# EAGLE design buffer-teensy (EAGLE 7.6.0)
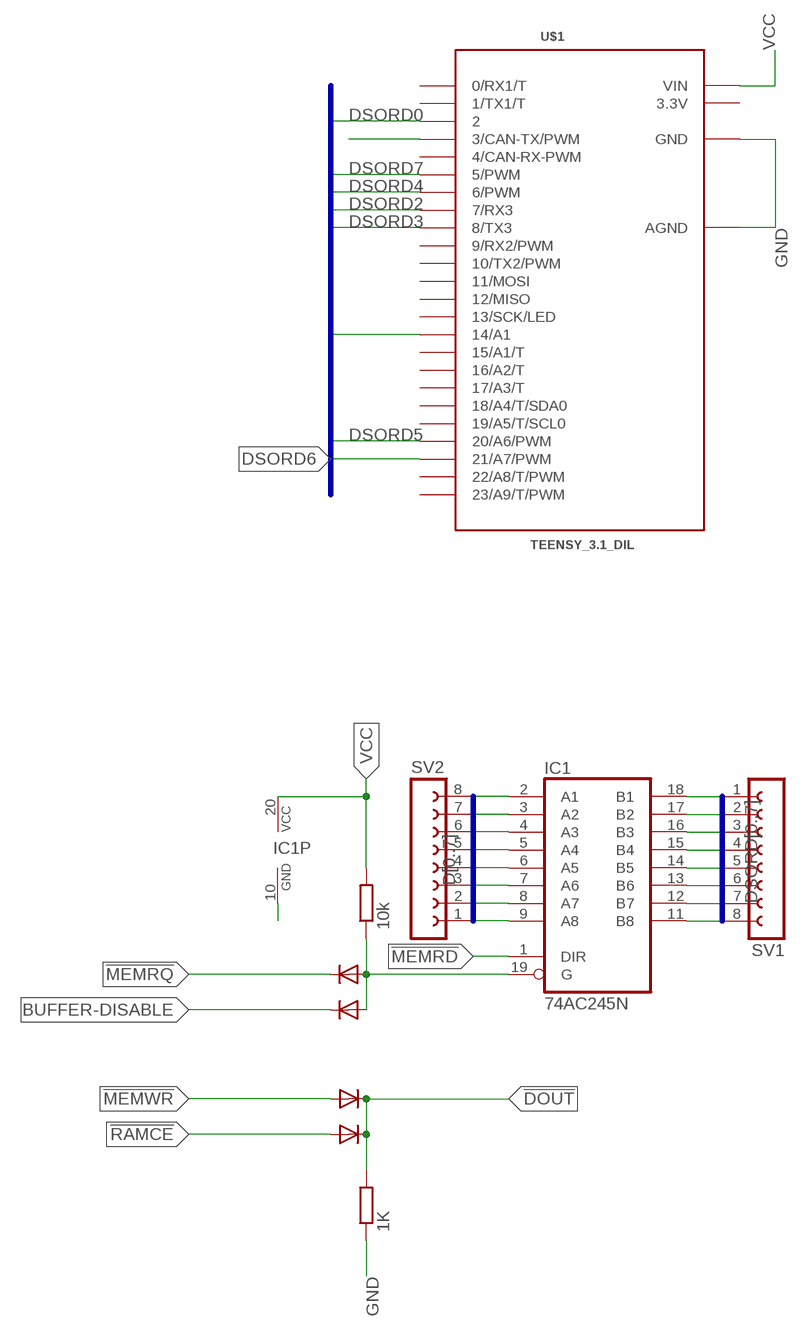
[diagram p0: schematic, sheet 1]

## Parts
D1  1N4148DO35-7  [DO35-7]
D2  1N4148DO35-7  [DO35-7]
D3  1N4148DO35-7  [DO35-7]
D4  1N4148DO35-7  [DO35-7]
IC1  74AC245N  [DIL20]
R1  10k  R-EU_0204/7  [0204/7]
R2  1K  R-EU_0204/7  [0204/7]
SV1  FE08-1  [FE08]
SV2  FE08-1  [FE08]
U$1  TEENSY_3.1_DIL  [TEENSY3-DIL]

## Nets
!DOUT: D3.C D4.C R2.2 U$1.3(3/CAN-TX/PWM)
!MEMRD: IC1.1(DIR)
!MEMRQ: D1.C
!MEMWR: D3.A
!RAMCE: D4.A
BUFFER-DISABLE: D2.C
D0: IC1.2(A1) SV2.8
D1: IC1.3(A2) SV2.7
D2: IC1.4(A3) SV2.6
D3: IC1.5(A4) SV2.5
D4: IC1.6(A5) SV2.4
D5: IC1.7(A6) SV2.3
D6: IC1.8(A7) SV2.2
D7: IC1.9(A8) SV2.1
DSORD0: IC1.18(B1) SV1.1 U$1.2
DSORD1: IC1.17(B2) SV1.2 U$1.14/A0(14/A1)
DSORD2: IC1.16(B3) SV1.3 U$1.7(7/RX3)
DSORD3: IC1.15(B4) SV1.4 U$1.8(8/TX3)
DSORD4: IC1.14(B5) SV1.5 U$1.6(6/PWM)
DSORD5: IC1.13(B6) SV1.6 U$1.20/A6(20/A6/PWM)
DSORD6: IC1.12(B7) SV1.7 U$1.21/A7(21/A7/PWM)
DSORD7: IC1.11(B8) SV1.8 U$1.5(5/PWM)
GND: IC1.10(GND) R2.1 U$1.AGND U$1.GND
N$3: D1.A D2.A IC1.19(G) R1.1
VCC: IC1.20(VCC) R1.2 U$1.VIN
Unconnected: U$1.0(0/RX1/T) U$1.1(1/TX1/T) U$1.4(4/CAN-RX-PWM) U$1.9(9/RX2/PWM) U$1.10(10/TX2/PWM) U$1.11(11/MOSI) U$1.12(12/MISO) U$1.13(13/SCK/LED) U$1.15/A1(15/A1/T) U$1.16/A2(16/A2/T) U$1.17/A3(17/A3/T) U$1.18/A4(18/A4/T/SDA0) U$1.19/A5(19/A5/T/SCL0) U$1.22/A8(22/A8/T/PWM) U$1.23/A9(23/A9/T/PWM)

## Buses
D[0..7]
DSORD[0..7]

## Power pins joined to a net without a drawn wire
3.3V: U$1.3.3V

## Library data of the parts
D1-D4 = diode:1N4148: DIODE high speed (Philips)
IC1 = 74xx-eu:74*245: Octal BUS TRANSCEIVER, 3-state
R1 R2 = rcl:R-EU_: RESISTOR, European symbol
SV1 SV2 = con-lsta:FE08-1: FEMALE HEADER; OC_FARNELL: unknown; OC_NEWARK: unknown
U$1 = Teensy_3_and_LC_Series_Boards_v1.1:TEENSY_3.1_DIL: Teensy 3.1 or 3.2 in a DIL Layout.

## Board
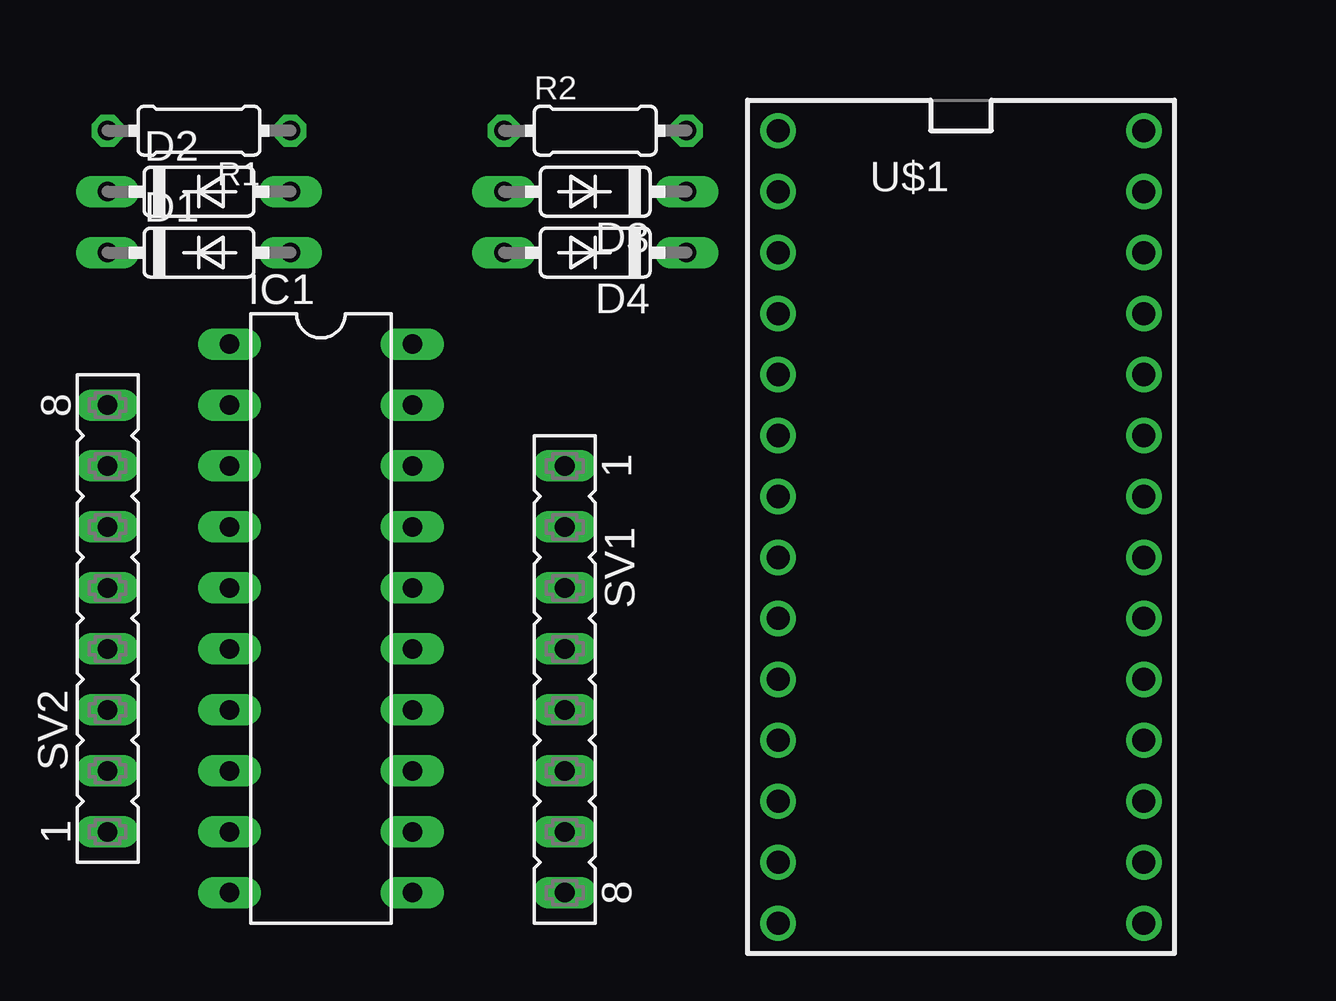
[diagram p1: board, top side]
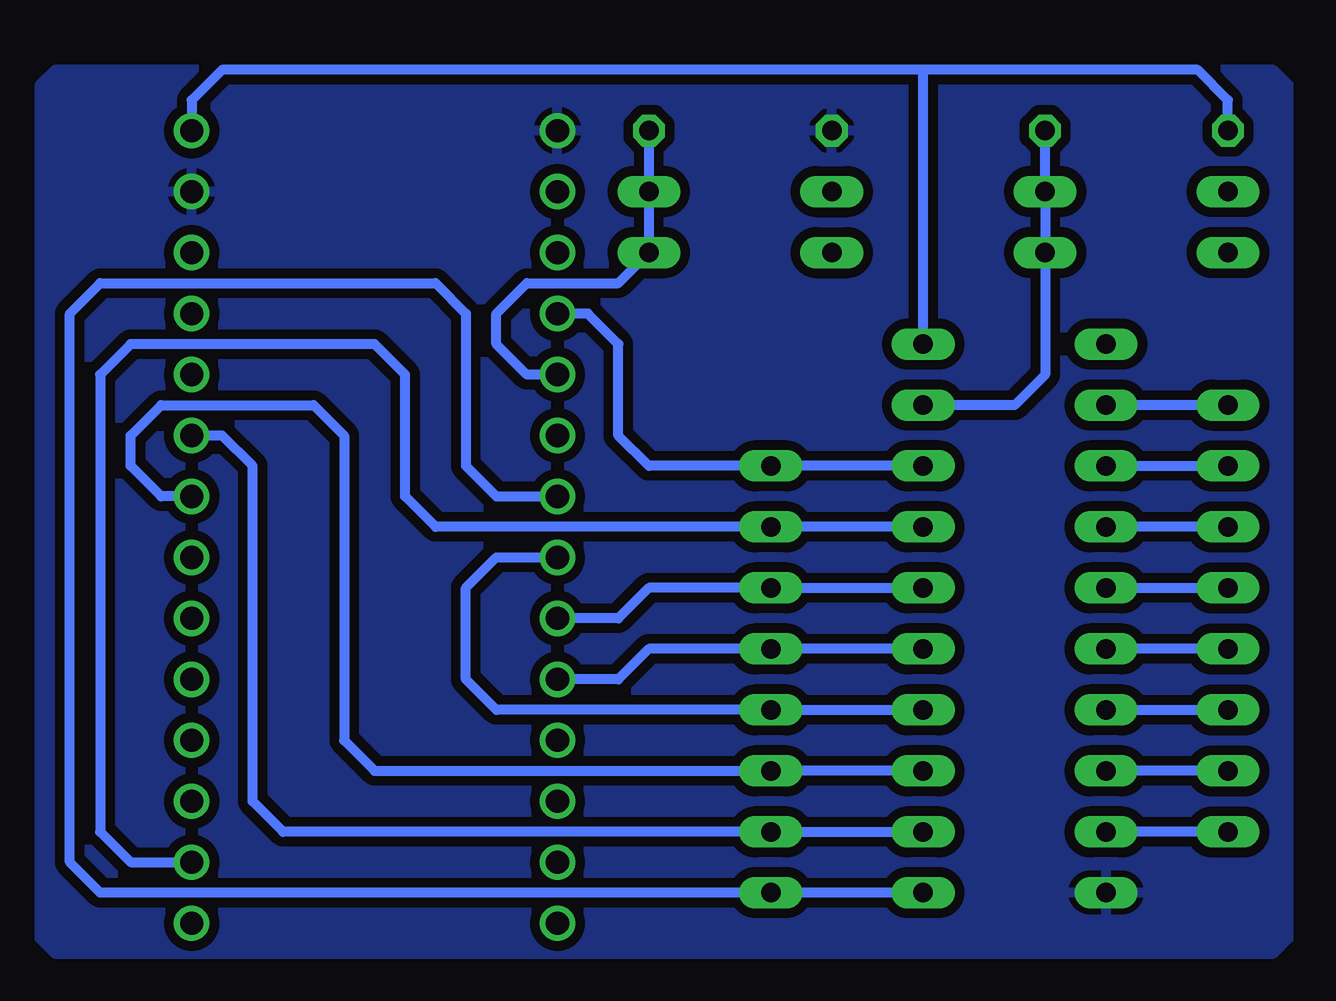
[diagram p2: board, bottom side, seen from below]

No outline drawn. Coordinates in mm, seen from the top.
Copper layers (1*16): Top 0.035mm / dielectric 1.5mm / Bottom 0.035mm
Design rules "default": minimum track width 10mil, minimum drill 24mil, track to track 8mil, track to pad 8mil, pad to pad 8mil, via to via 8mil, smd to smd 8mil, copper to edge 40mil, drill to drill 8mil, minimum pad ring 10mil, minimum via ring 8mil, stop-mask expansion 4mil, vias tented up to drill 0mil, thermal gap 10mil

### Footprints (pad centres in the part's own frame; a part is rotated, then mirrored left to right if it is on the bottom)
DO35-7 = drill 0.813 long: A 3.81,0; C -3.81,0
DIL20 = drill 0.813 long: 1 -11.43,-3.81; 2 -8.89,-3.81; 3 -6.35,-3.81; 4 -3.81,-3.81; 5 -1.27,-3.81; 6 1.27,-3.81; 7 3.81,-3.81; 8 6.35,-3.81; 9 8.89,-3.81; 10 11.43,-3.81; 11 11.43,3.81; 12 8.89,3.81; 13 6.35,3.81; 14 3.81,3.81; 15 1.27,3.81; 16 -1.27,3.81; 17 -3.81,3.81; 18 -6.35,3.81; 19 -8.89,3.81; 20 -11.43,3.81
0204/7 = drill 0.813 octagon: 1 -3.81,0; 2 3.81,0
FE08 = drill 0.813 long: 1 -8.89,0; 2 -6.35,0; 3 -3.81,0; 4 -1.27,0; 5 1.27,0; 6 3.81,0; 7 6.35,0; 8 8.89,0
TEENSY3-DIL = drill 0.965: 0 -7.62,13.97; 1 -7.62,11.43; 2 -7.62,8.89; 3 -7.62,6.35; 3.3V 7.62,11.43; 4 -7.62,3.81; 5 -7.62,1.27; 6 -7.62,-1.27; 7 -7.62,-3.81; 8 -7.62,-6.35; 9 -7.62,-8.89; 10 -7.62,-11.43; 11 -7.62,-13.97; 12 -7.62,-16.51; 13 7.62,-16.51; 14/A0 7.62,-13.97; 15/A1 7.62,-11.43; 16/A2 7.62,-8.89; 17/A3 7.62,-6.35; 18/A4 7.62,-3.81; 19/A5 7.62,-1.27; 20/A6 7.62,1.27; 21/A7 7.62,3.81; 22/A8 7.62,6.35; 23/A9 7.62,8.89; AGND 7.62,13.97; GND -7.62,16.51; VIN 7.62,16.51

### Placement (x,y rotation side)
D1  -3.81,7.62 0 top
D2  -3.81,10.16 0 top
D3  12.7,10.16 180 top
D4  12.7,7.62 180 top
IC1  1.27,-7.62 270 top
R1  -3.81,12.7 180 top
R2  12.7,12.7 0 top
SV1  11.43,-10.16 270 top
SV2  -7.62,-7.62 90 top
U$1  27.94,-3.81 0 top

### Tracks (layer width: path | path; a pad name or v marks a point on that pad's centre or on a via)
!DOUT
  Bottom 0.406: R2.2 D3.C D4.C 17.78,6.35 21.59,6.35 22.86,5.08 22.86,3.81 21.59,2.54 U$1.3
D0
  Bottom 0.406: SV2.8 IC1.2
D1
  Bottom 0.406: IC1.3 SV2.7
D2
  Bottom 0.406: SV2.6 IC1.4
D3
  Bottom 0.406: IC1.5 SV2.5
D4
  Bottom 0.406: SV2.4 IC1.6
D5
  Bottom 0.406: IC1.7 SV2.3
D6
  Bottom 0.406: SV2.2 IC1.8
D7
  Bottom 0.406: SV2.1 IC1.9
DSORD0
  Bottom 0.406: IC1.18 SV1.1 16.51,-1.27 17.78,0 17.78,3.81 19.05,5.08 U$1.2
DSORD1
  Bottom 0.406: IC1.17 SV1.2 25.4,-3.81 26.67,-2.54 26.67,2.54 27.94,3.81 38.1,3.81 39.37,2.54 39.37,-16.51 38.1,-17.78 U$1.14/A0
DSORD2
  Bottom 0.406: IC1.16 SV1.3 16.51,-6.35 17.78,-7.62 U$1.7
DSORD3
  Bottom 0.406: IC1.15 SV1.4 16.51,-8.89 17.78,-10.16 U$1.8
DSORD4
  Bottom 0.406: IC1.14 SV1.5 22.86,-11.43 24.13,-10.16 24.13,-6.35 22.86,-5.08 U$1.6
DSORD5
  Bottom 0.406: IC1.13 SV1.6 27.94,-13.97 29.21,-12.7 29.21,0 30.48,1.27 36.83,1.27 38.1,0 38.1,-1.27 36.83,-2.54 U$1.20/A6
DSORD6
  Bottom 0.406: IC1.12 SV1.7 31.75,-16.51 33.02,-15.24 33.02,-1.27 34.29,0 U$1.21/A7
DSORD7
  Bottom 0.406: IC1.11 SV1.8 39.37,-19.05 40.64,-17.78 40.64,5.08 39.37,6.35 25.4,6.35 24.13,5.08 24.13,-1.27 22.86,-2.54 U$1.5
GND
  pour Bottom (isolate 0.406): -10.16,-20.95 -10.16,14.61 -9.53,15.24 41.27,15.24 41.91,14.61 41.91,-20.95 41.27,-21.59 -9.53,-21.59
N$3
  Bottom 0.406: IC1.19 1.27,1.27 0,2.54 D1.A D2.A R1.1
VCC
  Bottom 0.406: 5.08,15.24 34.29,15.24 35.56,13.97 U$1.VIN | R1.2 -7.62,13.97 -6.35,15.24 5.08,15.24 | IC1.20 5.08,15.24